# EAGLE design TeslaBMS_Shield_2 (EAGLE 6.6.0)
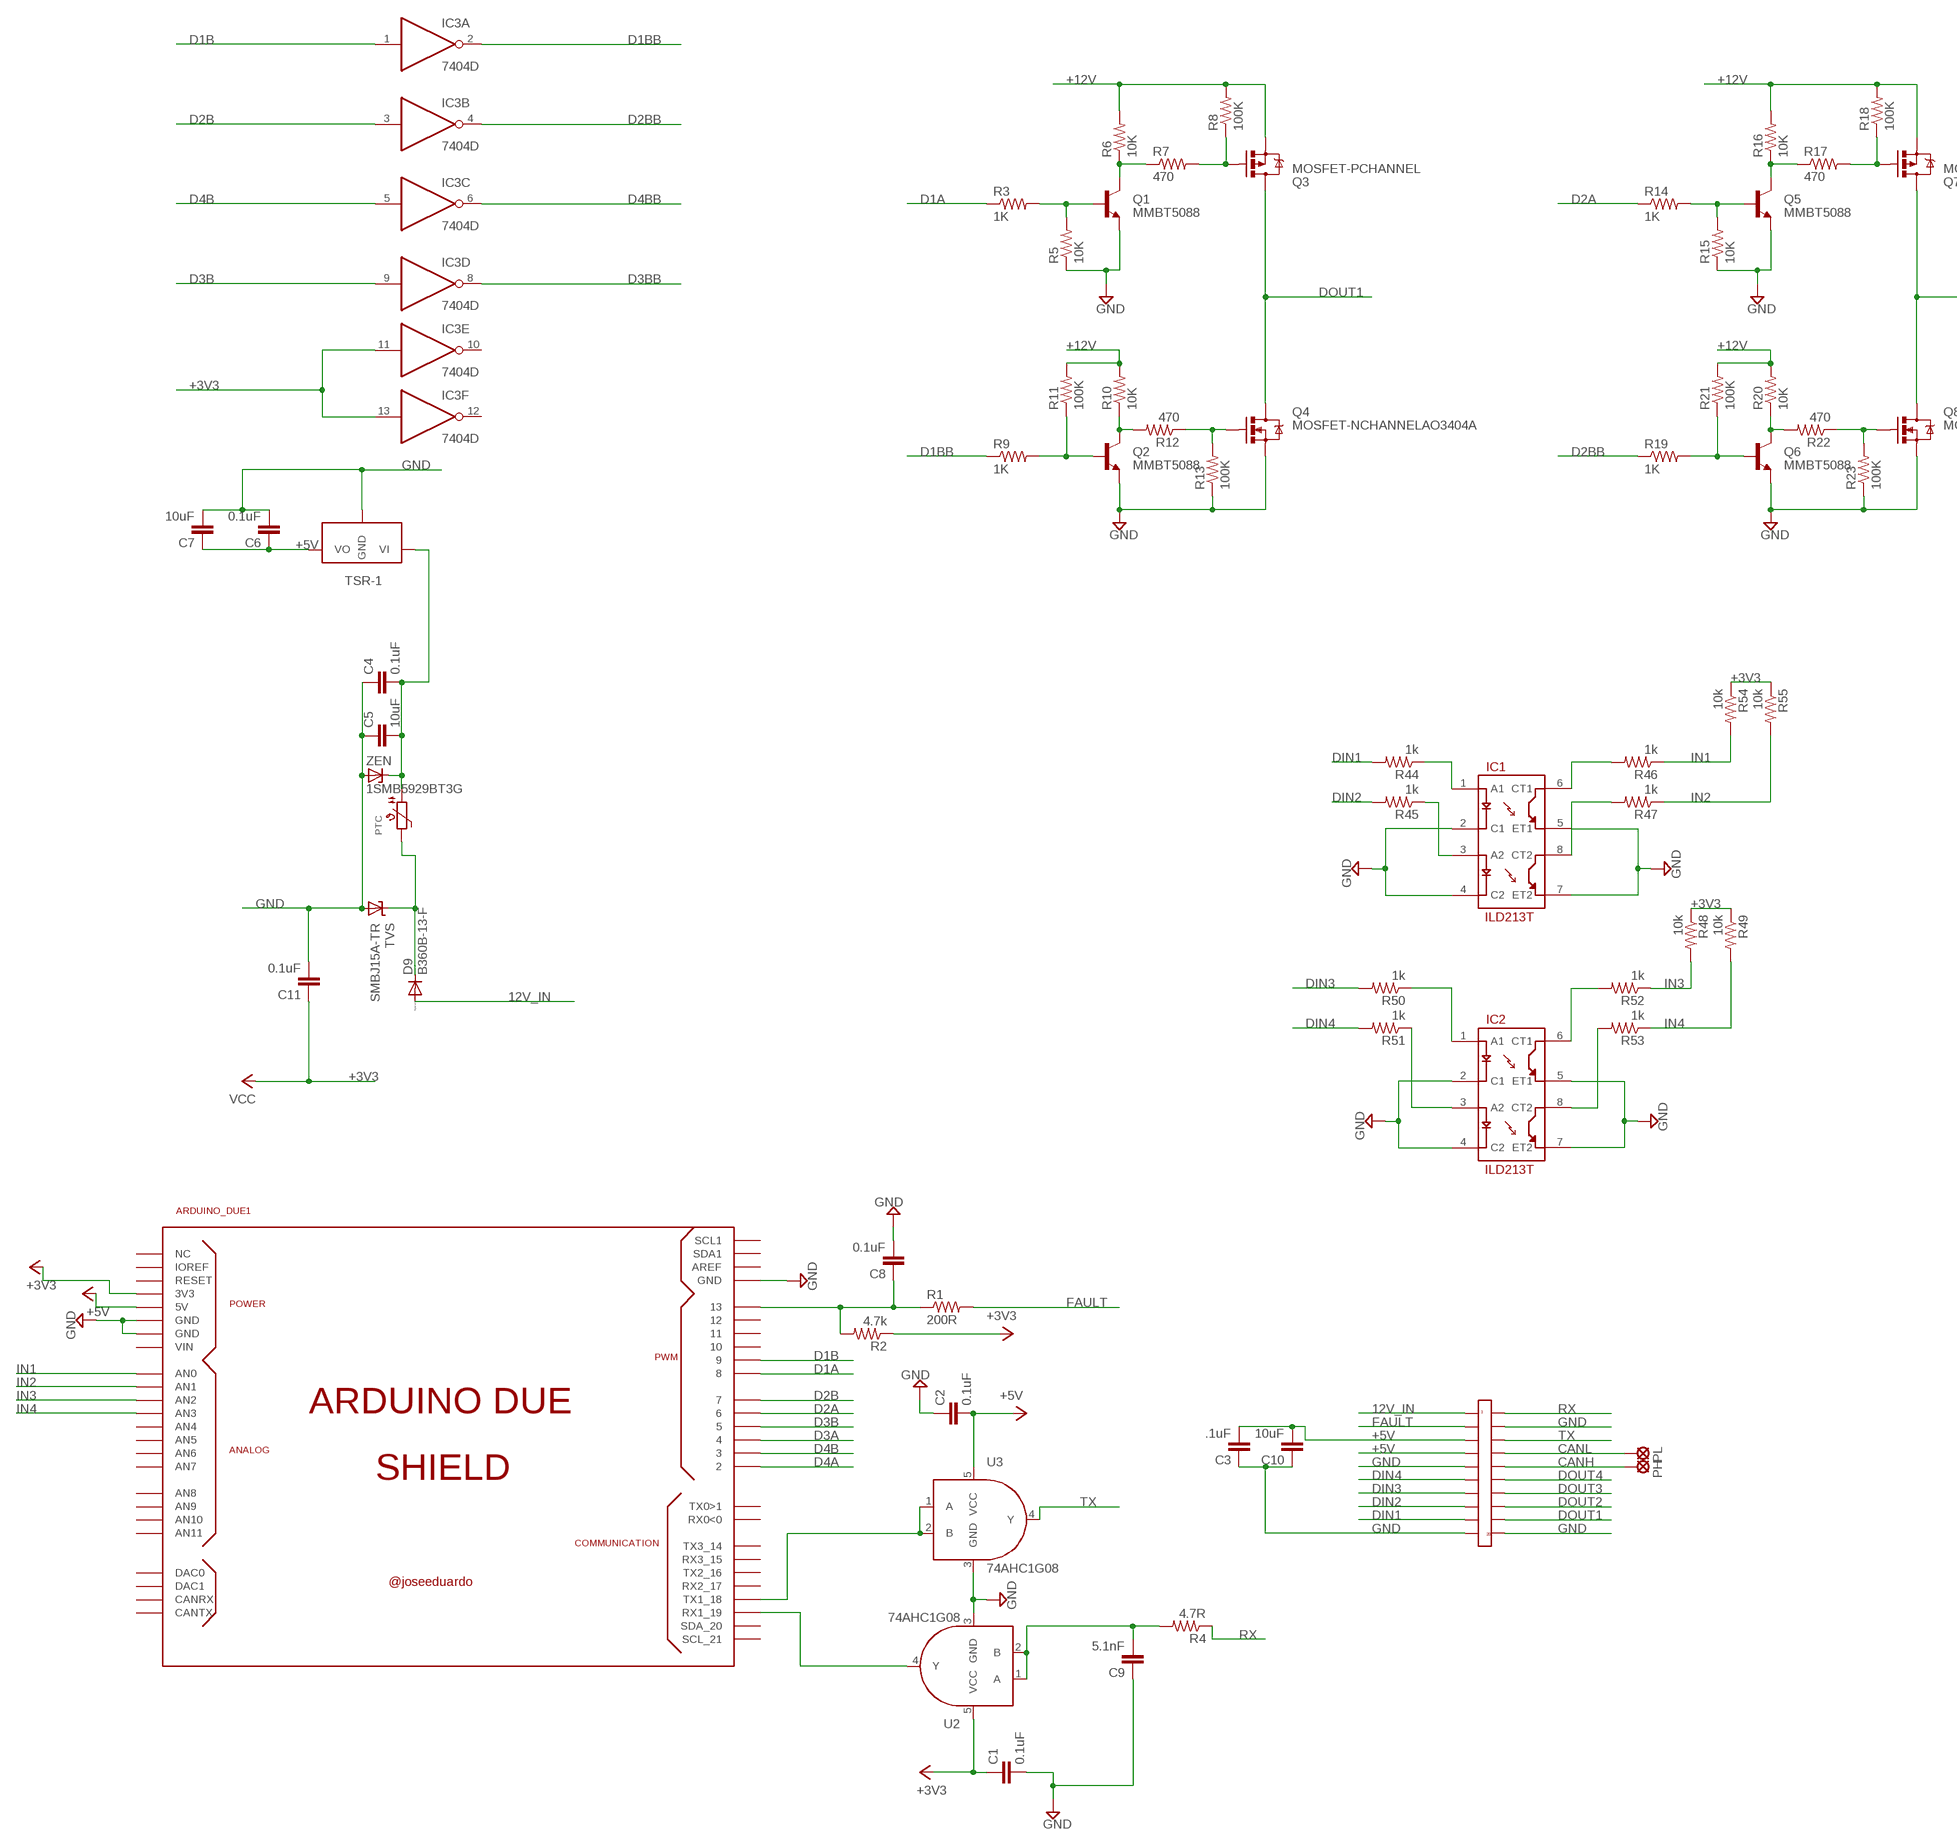
[diagram p0: schematic, sheet 1, part 1 of 2]
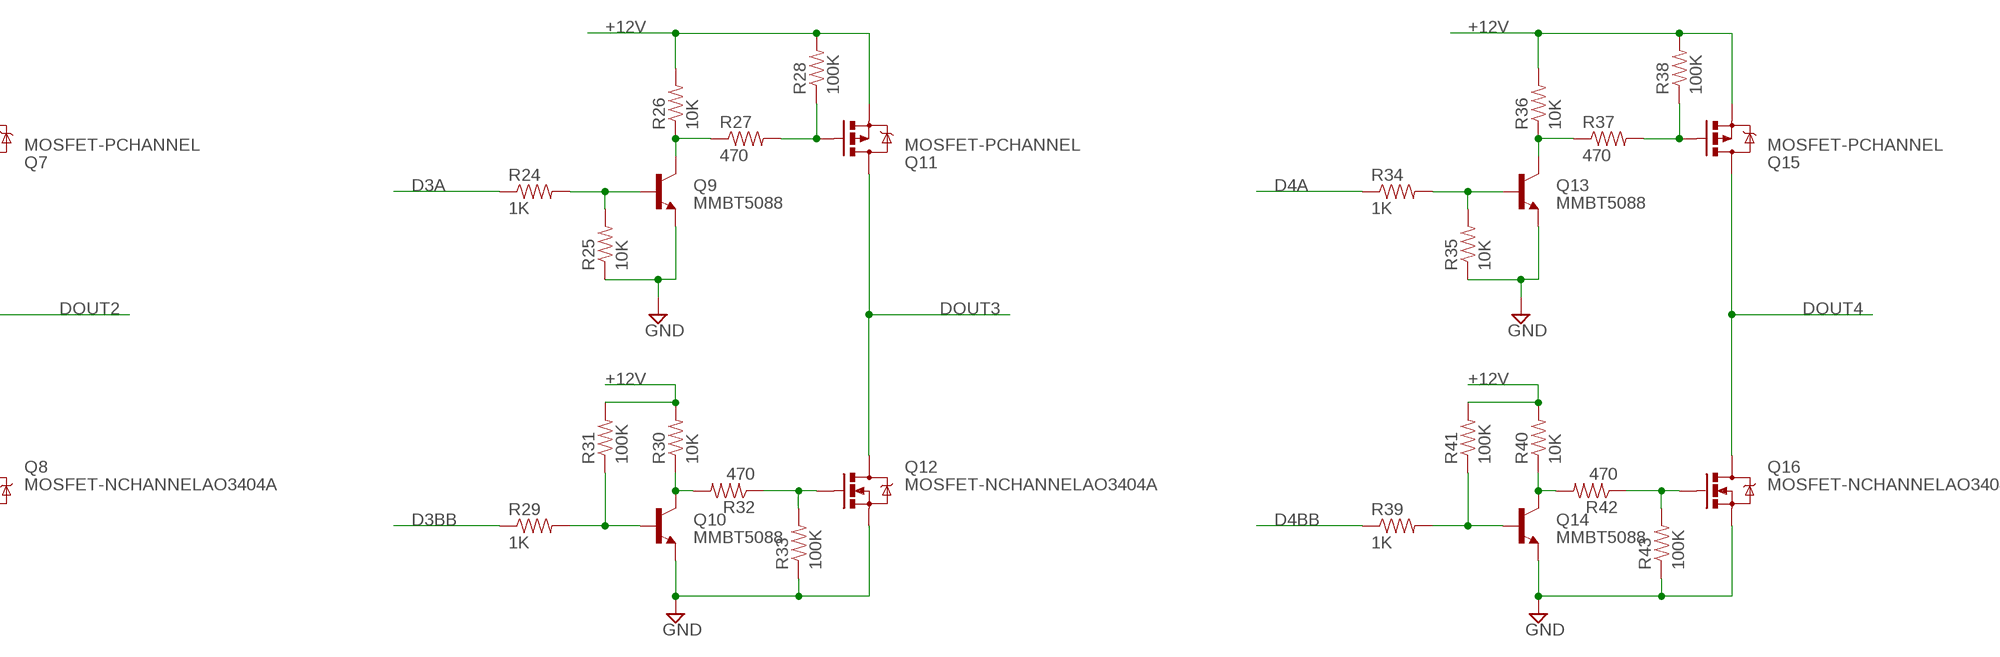
[diagram p1: schematic, sheet 1, part 2 of 2]

## Parts
ARDUINO_DUE1  ARDUINO_DUE_SHIELD  [ARDUINO_DUE_SHIELD]
C1  0.1uF  CAP0603-CAP  [0603-CAP]
C2  0.1uF  CAP0603-CAP  [0603-CAP]
C3  .1uF  CAP0603-CAP  [0603-CAP]
C4  0.1uF  CAP0805  [0805]
C5  10uF  CAP0805  [0805]
C6  0.1uF  CAP0805  [0805]
C7  10uF  CAP0805  [0805]
C8  0.1uF  CAP0603-CAP  [0603-CAP]
C9  5.1nF  CAP0603-CAP  [0603-CAP]
C10  10uF  CAP0603-CAP  [0603-CAP]
C11  0.1uF  CAP0805  [0805]
D9  B360B-13-F  DIODE-SMB  [SMB]
IC1  ILD213T  [SO08]
IC2  ILD213T  [SO08]
IC3  7404D  [SO14]
PH  SE11  [SE11]
PL  SE11  [SE11]
PTC  PTC1812  [PTC1812]
Q1  MMBT5088  TRANSISTOR_NPNMMBT5088  [SOT23-3]
Q2  MMBT5088  TRANSISTOR_NPNMMBT5088  [SOT23-3]
Q3  MOSFET-PCHANNEL  [SOT23-3]
Q4  MOSFET-NCHANNELAO3404A  [SOT23-3]
Q5  MMBT5088  TRANSISTOR_NPNMMBT5088  [SOT23-3]
Q6  MMBT5088  TRANSISTOR_NPNMMBT5088  [SOT23-3]
Q7  MOSFET-PCHANNEL  [SOT23-3]
Q8  MOSFET-NCHANNELAO3404A  [SOT23-3]
Q9  MMBT5088  TRANSISTOR_NPNMMBT5088  [SOT23-3]
Q10  MMBT5088  TRANSISTOR_NPNMMBT5088  [SOT23-3]
Q11  MOSFET-PCHANNEL  [SOT23-3]
Q12  MOSFET-NCHANNELAO3404A  [SOT23-3]
Q13  MMBT5088  TRANSISTOR_NPNMMBT5088  [SOT23-3]
Q14  MMBT5088  TRANSISTOR_NPNMMBT5088  [SOT23-3]
Q15  MOSFET-PCHANNEL  [SOT23-3]
Q16  MOSFET-NCHANNELAO3404A  [SOT23-3]
R1  200R  RESISTOR0603-RES  [0603-RES]
R2  4.7k  RESISTOR0603-RES  [0603-RES]
R3  1K  RESISTOR0402  [0402-RES]
R4  4.7R  RESISTOR0603-RES  [0603-RES]
R5  10K  RESISTOR0402  [0402-RES]
R6  10K  RESISTOR0402  [0402-RES]
R7  470  RESISTOR0402  [0402-RES]
R8  100K  RESISTOR0402  [0402-RES]
R9  1K  RESISTOR0402  [0402-RES]
R10  10K  RESISTOR0402  [0402-RES]
R11  100K  RESISTOR0402  [0402-RES]
R12  470  RESISTOR0402  [0402-RES]
R13  100K  RESISTOR0402  [0402-RES]
R14  1K  RESISTOR0402  [0402-RES]
R15  10K  RESISTOR0402  [0402-RES]
R16  10K  RESISTOR0402  [0402-RES]
R17  470  RESISTOR0402  [0402-RES]
R18  100K  RESISTOR0402  [0402-RES]
R19  1K  RESISTOR0402  [0402-RES]
R20  10K  RESISTOR0402  [0402-RES]
R21  100K  RESISTOR0402  [0402-RES]
R22  470  RESISTOR0402  [0402-RES]
R23  100K  RESISTOR0402  [0402-RES]
R24  1K  RESISTOR0402  [0402-RES]
R25  10K  RESISTOR0402  [0402-RES]
R26  10K  RESISTOR0402  [0402-RES]
R27  470  RESISTOR0402  [0402-RES]
R28  100K  RESISTOR0402  [0402-RES]
R29  1K  RESISTOR0402  [0402-RES]
R30  10K  RESISTOR0402  [0402-RES]
R31  100K  RESISTOR0402  [0402-RES]
R32  470  RESISTOR0402  [0402-RES]
R33  100K  RESISTOR0402  [0402-RES]
R34  1K  RESISTOR0402  [0402-RES]
R35  10K  RESISTOR0402  [0402-RES]
R36  10K  RESISTOR0402  [0402-RES]
R37  470  RESISTOR0402  [0402-RES]
R38  100K  RESISTOR0402  [0402-RES]
R39  1K  RESISTOR0402  [0402-RES]
R40  10K  RESISTOR0402  [0402-RES]
R41  100K  RESISTOR0402  [0402-RES]
R42  470  RESISTOR0402  [0402-RES]
R43  100K  RESISTOR0402  [0402-RES]
R44  1k  RESISTOR0603-RES  [0603-RES]
R45  1k  RESISTOR0603-RES  [0603-RES]
R46  1k  RESISTOR0603-RES  [0603-RES]
R47  1k  RESISTOR0603-RES  [0603-RES]
R48  10k  RESISTOR0603-RES  [0603-RES]
R49  10k  RESISTOR0603-RES  [0603-RES]
R50  1k  RESISTOR0603-RES  [0603-RES]
R51  1k  RESISTOR0603-RES  [0603-RES]
R52  1k  RESISTOR0603-RES  [0603-RES]
R53  1k  RESISTOR0603-RES  [0603-RES]
R54  10k  RESISTOR0603-RES  [0603-RES]
R55  10k  RESISTOR0603-RES  [0603-RES]
TVS  SMBJ15A-TR  SUPPRESSOR-SMBJ  [SMBJ]
U2  74AHC1G08  [SOT353]
U3  74AHC1G08  [SOT353]
U9  TSR-1  [TSR-1]
U$2  VAL-U-LOK-20PIN  [VALULOK-20]
ZEN  1SMB5929BT3G  ZENER-DIODESMB  [SMB]

## Nets
12V_IN: D9.A U$2.P$1
+3V3: ARDUINO_DUE1.3V3 C1.1 C11.1 IC3.11(E:I) IC3.13(F:I) R2.1 R48.1 R49.1 R54.1 R55.1 U2.5(VCC) ; supply symbol labelled VCC
+5V: ARDUINO_DUE1.5V0(5V) C2.2 C3.2 C6.1 C7.1 C10.2 U3.5(VCC) U9.P$3(VO) U$2.P$3 U$2.P$4
+12V: C4.2 C5.2 PTC.P$1 Q3.2(S) Q7.2(S) Q11.2(S) Q15.2(S) R6.2 R8.2 R10.2 R11.2 R16.2 R18.2 R20.2 R21.2 R26.2 R28.2 R30.2 R31.2 R36.2 R38.2 R40.2 R41.2 U9.P$1(VI) ZEN.C
CANH: PH.MP U$2.P$15
CANL: PL.MP U$2.P$14
D1A: ARDUINO_DUE1.8 R3.1
D1B: ARDUINO_DUE1.9 IC3.1(A:I)
D1BB: IC3.2(A:O) R9.1
D2A: ARDUINO_DUE1.6 R14.1
D2B: ARDUINO_DUE1.7 IC3.3(B:I)
D2BB: IC3.4(B:O) R19.1
D3A: ARDUINO_DUE1.4 R24.1
D3B: ARDUINO_DUE1.5 IC3.9(D:I)
D3BB: IC3.8(D:O) R29.1
D4A: ARDUINO_DUE1.2 R34.1
D4B: ARDUINO_DUE1.3 IC3.5(C:I)
D4BB: IC3.6(C:O) R39.1
DIN1: R44.2 U$2.P$9
DIN2: R45.2 U$2.P$8
DIN3: R50.2 U$2.P$7
DIN4: R51.2 U$2.P$6
DOUT1: Q3.3(D) Q4.3(D) U$2.P$19
DOUT2: Q7.3(D) Q8.3(D) U$2.P$18
DOUT3: Q11.3(D) Q12.3(D) U$2.P$17
DOUT4: Q15.3(D) Q16.3(D) U$2.P$16
FAULT: R1.2 U$2.P$2
GND: ARDUINO_DUE1.GND ARDUINO_DUE1.GND_1(GND) ARDUINO_DUE1.GND_4(GND) C1.2 C2.1 C3.1 C4.1 C5.1 C6.2 C7.2 C8.2 C9.1 C10.1 C11.2 IC1.2(C1) IC1.4(C2) IC1.5(ET1) IC1.7(ET2) IC2.2(C1) IC2.4(C2) IC2.5(ET1) IC2.7(ET2) Q1.2(E) Q2.2(E) Q4.2(S) Q5.2(E) Q6.2(E) Q8.2(S) Q9.2(E) Q10.2(E) Q12.2(S) Q13.2(E) Q14.2(E) Q16.2(S) R5.1 R13.1 R15.1 R23.1 R25.1 R33.1 R35.1 R43.1 TVS.A U2.3(GND) U3.3(GND) U9.P$2(GND) U$2.P$5 U$2.P$10 U$2.P$12 U$2.P$20 ZEN.A
IN1: ARDUINO_DUE1.A0(AN0) R46.1 R54.2
IN2: ARDUINO_DUE1.A1(AN1) R47.1 R55.2
IN3: ARDUINO_DUE1.A2(AN2) R48.2 R52.1
IN4: ARDUINO_DUE1.A3(AN3) R49.2 R53.1
N$1: D9.C PTC.P$2 TVS.C
N$2: ARDUINO_DUE1.19(RX1_19) U2.4(Y)
N$3: ARDUINO_DUE1.18(TX1_18) U3.1(A) U3.2(B)
N$4: Q1.1(B) R3.2 R5.2
N$5: Q3.1(G) R7.2 R8.1
N$6: IC1.3(A2) R45.1
N$7: ARDUINO_DUE1.13 C8.1 R1.1 R2.2
N$8: Q1.3(C) R6.1 R7.1
N$9: C9.2 R4.2 U2.1(A) U2.2(B)
N$10: Q5.1(B) R14.2 R15.2
N$11: Q2.1(B) R9.2 R11.1
N$12: Q4.1(G) R12.1 R13.2
N$13: Q2.3(C) R10.1 R12.2
N$14: Q5.3(C) R16.1 R17.1
N$15: Q7.1(G) R17.2 R18.1
N$16: Q6.1(B) R19.2 R21.1
N$17: Q8.1(G) R22.1 R23.2
N$18: Q6.3(C) R20.1 R22.2
N$19: Q9.1(B) R24.2 R25.2
N$20: Q9.3(C) R26.1 R27.1
N$21: Q11.1(G) R27.2 R28.1
N$22: Q10.1(B) R29.2 R31.1
N$23: Q12.1(G) R32.1 R33.2
N$24: Q10.3(C) R30.1 R32.2
N$25: Q13.1(B) R34.2 R35.2
N$26: Q13.3(C) R36.1 R37.1
N$27: Q15.1(G) R37.2 R38.1
N$28: Q14.1(B) R39.2 R41.1
N$29: Q16.1(G) R42.1 R43.2
N$30: Q14.3(C) R40.1 R42.2
N$31: IC1.1(A1) R44.1
N$32: IC2.6(CT1) R52.2
N$36: IC2.8(CT2) R53.2
N$37: IC1.6(CT1) R46.2
N$38: IC1.8(CT2) R47.2
N$41: IC2.1(A1) R50.1
N$42: IC2.3(A2) R51.1
RX: R4.1 U$2.P$11
TX: U3.4(Y) U$2.P$13
Unconnected: ARDUINO_DUE1.0(RX0<0) ARDUINO_DUE1.1(TX0>1) ARDUINO_DUE1.10 ARDUINO_DUE1.11 ARDUINO_DUE1.12 ARDUINO_DUE1.14(TX3_14) ARDUINO_DUE1.15(RX3_15) ARDUINO_DUE1.16(TX2_16) ARDUINO_DUE1.17(RX2_17) ARDUINO_DUE1.20(SDA_20) ARDUINO_DUE1.21(SCL_21) ARDUINO_DUE1.A4(AN4) ARDUINO_DUE1.A5(AN5) ARDUINO_DUE1.A6(AN6) ARDUINO_DUE1.A7(AN7) ARDUINO_DUE1.A8(AN8) ARDUINO_DUE1.A9(AN9) ARDUINO_DUE1.A10(AN10) ARDUINO_DUE1.A11(AN11) ARDUINO_DUE1.AREF ARDUINO_DUE1.CANRX ARDUINO_DUE1.CANTX ARDUINO_DUE1.DAC0 ARDUINO_DUE1.DAC1 ARDUINO_DUE1.IOREF ARDUINO_DUE1.NC_2(NC) ARDUINO_DUE1.RESET ARDUINO_DUE1.SCL1 ARDUINO_DUE1.SDA1 ARDUINO_DUE1.VIN IC3.10(E:O) IC3.12(F:O)

## Power pins joined to a net without a drawn wire
+3V3: IC3.14(P:VCC)
GND: IC3.7(P:GND)

## Library data of the parts
ARDUINO_DUE1 = arduino_due_shield:ARDUINO_DUE_SHIELD
C1-C11 = SparkFun-Passives:CAP: Capacitor Standard 0603 ceramic capacitor, and 0.1" leaded capacitor.
D9 = diode:DIODE-: DIODE
IC1 IC2 = SparkFun-DiscreteSemi:ILD213T: Dual optoisolator.
IC3 = 74xx-us:74*04: Hex INVERTER
PH PL = solpad:SE11: SOLDER PAD RTM, drill 1,1mm, distributor Buerklin, 07F810
PTC = microbuilder:PTC: PTC (Resettable Fuse) 1206 Package 250mA PTC (16V Max, Time-to-Trip: 0.08s) - Digikey: F2110CT-ND 1210 Package 100mA PTC (30V Max, Time-to-Trip: 0.6s) - Digikey: MF-USMF010-2CT-ND 1812 Package 750mA PTC (24V Max, Time-to-Trip: 0.2s) - Digikey: MF-MSMF075/24-2CT-ND
Q1 Q2 Q5 Q6 Q9 Q10 Q13 Q14 = SparkFun-DiscreteSemi:TRANSISTOR_NPN: Generic NPN BJT MMBT2222A - TRANS-08049 (SOT-23, 1A 40V) MPSA42 - TRANS-09116 (SOT-23, 500mA 300V) MMBT5088LT1G - TRANS-11160 (SOT-23, 50 mA 30V) BC547 - COM-08928 <http://www.sparkfun.com/products/8928> (TO-92 45V 100mA) (1.Collector 2.Base 3.Emitter) 2N3904 - COM-00521 <http://www.sparkfun.com/products/521> (TO-92 40V 200mA) (1.Emitter 2.Base 3.Collector) P2N2222A - COM-12852 <http://www.sparkfun.com/products/12852> (TO-92 40V 600mA) (1.Collector 2.Base 3.Emitter); PROD_ID: TRANS-11160
Q3 Q7 Q11 Q15 = SparkFun-DiscreteSemi:MOSFET-PCHANNEL: Generic PMOSFET IRLML2244 - TRANS-11153 (SOT-23 -20V -4.3A) (1.Gate 2.Source 3.Drain) FQP27P06 - COM-10349 <http://www.sparkfun.com/products/10349> (TO-220 -60V -27A) (1.Gate 2.Source 3.Drain); PROD_ID: TRANS-08285
Q4 Q8 Q12 Q16 = SparkFun-DiscreteSemi:MOSFET-NCHANNEL: Common NMOSFET Parts MFG P/N Store ID Prod ID FDD8780 TRANS-09984 SI7820DN TRANS-11055 FDS6630A IC-08089 2N7002PW TRANS-11151 FQP30N06L COM-10213 TRANS-10060 BSS123LT1G TRANS-08345 BSS138 TRANS-00830 BS170 2N7000; PROD_ID: TRAN-12988
R1 R2 R4 R44-R55 = SparkFun-Passives:RESISTOR: Resistor Basic schematic elements and footprints for 0603, 1206, and PTH resistors.
R3 R5-R43 = SparkFun-Resistors:RESISTOR: Resistor Basic schematic elements and footprints for 0603, 1206, and PTH resistors.
TVS = diode:SUPPRESSOR-: Suppressor diode
U2 U3 = SparkFun-DigitalIC:74AHC1G08: Single 2-input AND gate; PROD_ID: IC-10841
U9 = Traco:TSR-1
U$2 = ck_custom:VAL-U-LOK-20PIN
ZEN = diode:ZENER-DIODE: Z-Diode

## Net classes
0 default: width 0.203 mm, drill 0.305 mm, clearance 0.203 mm

## Board
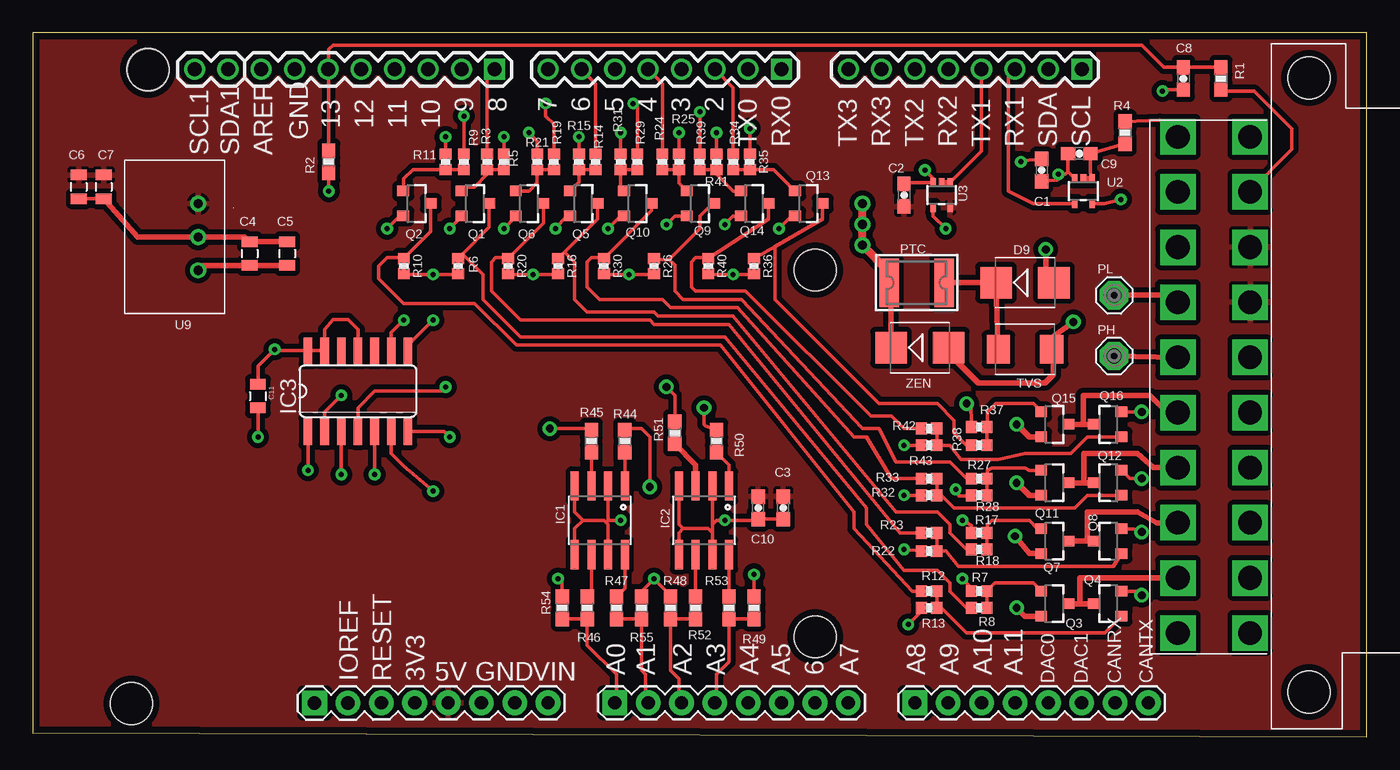
[diagram p2: board, top side]
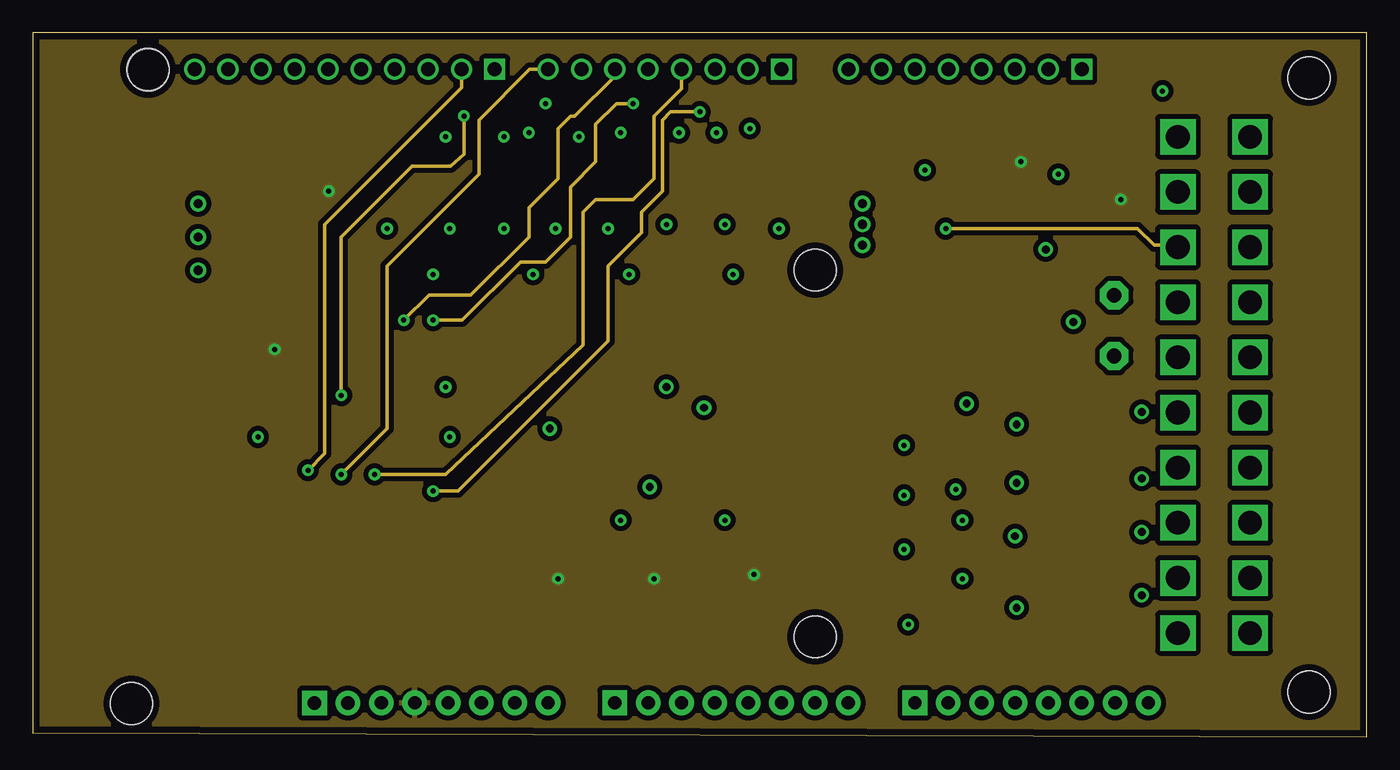
[diagram p3: board, inner layer Route2]
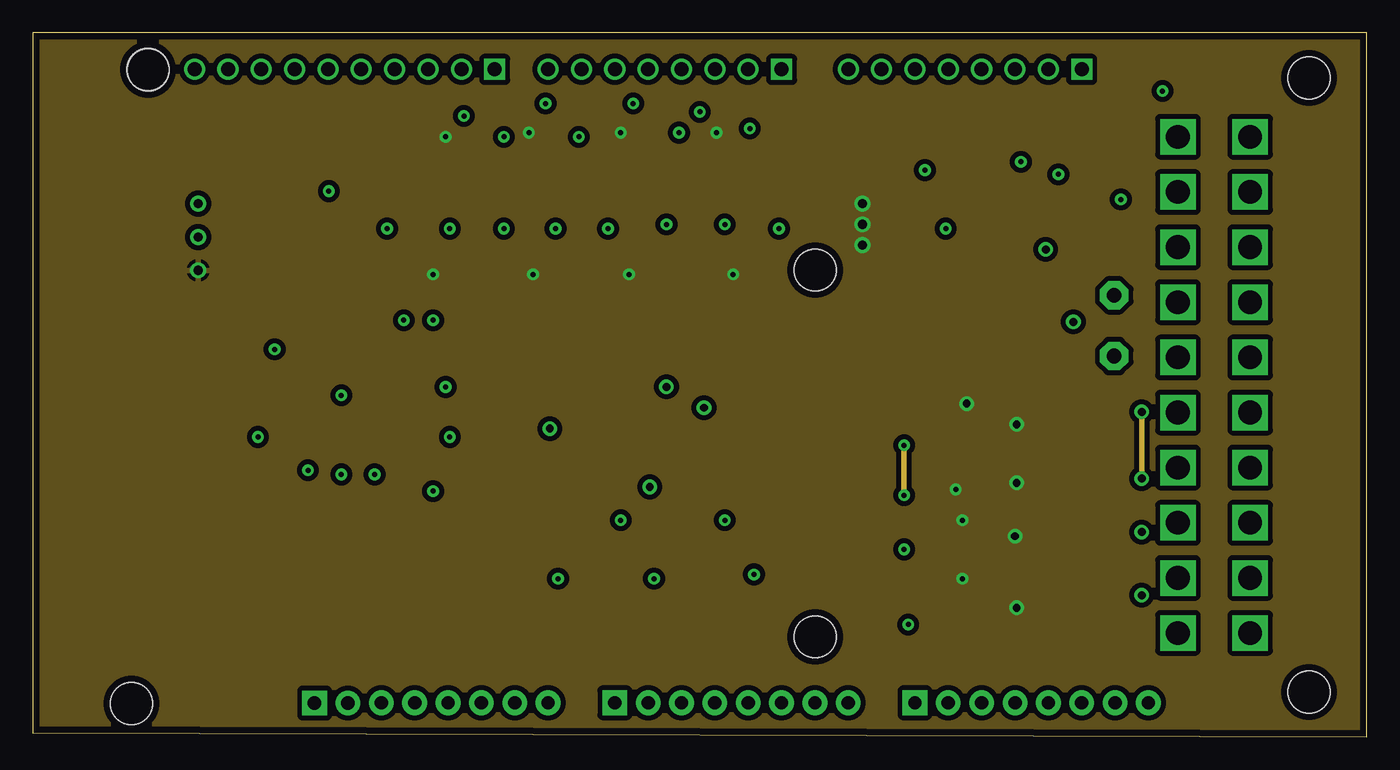
[diagram p4: board, inner layer Route15]
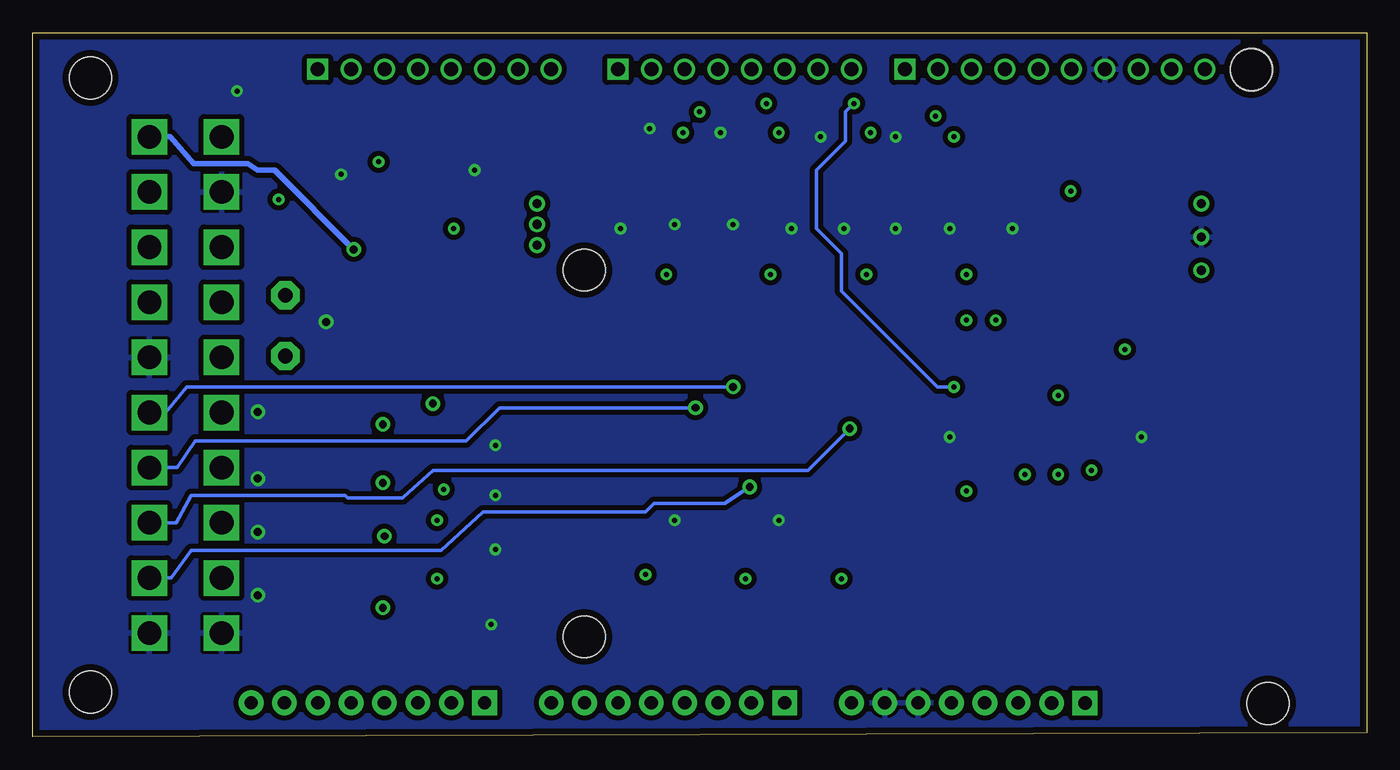
[diagram p5: board, bottom side, seen from below]

Size 101.59 x 53.65 mm. Coordinates in mm from the lower left corner, seen from the top.
Outline: 0,0.32 101.59,0 101.59,53.65 0,53.65 0,0.32
Copper layers (1+2*15+16): Top 0.0178mm / dielectric 12mil / Route2 0.0356mm / dielectric 28mil / Route15 0.0356mm / dielectric 12mil / Bottom 0.0178mm
Design rules "SSC-EAGLE-4Lyr_v1.0.0.3 *": minimum track width 6mil, minimum drill 8mil, track to track 15mil, track to pad 15mil, pad to pad 15mil, via to via 15mil, smd to smd 6mil, copper to edge 20mil, drill to drill 16mil, minimum pad ring 10mil, minimum via ring 10mil, stop-mask expansion 10mil, vias tented up to drill 0mil, thermal gap 10mil

### Footprints (pad centres in the part's own frame; a part is rotated, then mirrored left to right if it is on the bottom)
ARDUINO_DUE_SHIELD = drill 1.067 square: 0 63.373,51.816; 8 41.529,51.816; 21 86.233,51.816 | drill 1.067: 1 60.833,51.816; 2 58.293,51.816; 3 55.753,51.816; 4 53.213,51.816; 5 50.673,51.816; 6 48.133,51.816; 7 45.593,51.816; 9 38.989,51.816; 10 36.449,51.816; 11 33.909,51.816; 12 31.369,51.816; 13 28.829,51.816; 14 68.453,51.816; 15 70.993,51.816; 16 73.533,51.816; 17 76.073,51.816; 18 78.613,51.816; 19 81.153,51.816; 20 83.693,51.816; AREF 23.749,51.816; GND_4 26.289,51.816; SCL1 18.669,51.816; SDA1 21.209,51.816 | drill 1.016 pad 1.88: 3V3 35.433,3.556; 5V0 37.973,3.556; A1 53.213,3.556; A2 55.753,3.556; A3 58.293,3.556; A4 60.833,3.556; A5 63.373,3.556; A6 65.913,3.556; A7 68.453,3.556; A9 76.073,3.556; A10 78.613,3.556; A11 81.153,3.556; CANRX 88.773,3.556; CANTX 91.313,3.556; DAC0 83.693,3.556; DAC1 86.233,3.556; GND 40.513,3.556; GND_1 43.053,3.556; IOREF 30.346,3.543; RESET 32.893,3.555; VIN 45.593,3.556 | drill 1.016 pad 1.88 square: A0 50.673,3.556; A8 73.533,3.556; NC_2 27.806,3.543 | hole 3.2: 15.113,51.816; 15.138,51.765; 13.868,3.505; 65.938,36.525; 65.938,8.585
0603-CAP = smd 1.1 x 1: 1 -0.85,0; 2 0.85,0
0805 = smd 0.8 x 1.2: 1 -0.9,0; 2 0.9,0
SMB = smd 2.4 x 2.4: A 2.2,0; C -2.2,0
SO08 = smd 0.61 x 2.21: 1 -1.905,-2.616; 2 -0.635,-2.616; 3 0.635,-2.616; 4 1.905,-2.616; 5 1.905,2.616; 6 0.635,2.616; 7 -0.635,2.616; 8 -1.905,2.616
SO14 = smd 0.66 x 2.032: 1 -3.81,-3.073; 2 -2.54,-3.073; 3 -1.27,-3.073; 4 0,-3.073; 5 1.27,-3.073; 6 2.54,-3.073; 7 3.81,-3.073; 8 3.81,3.073; 9 2.54,3.073; 10 1.27,3.073; 11 0,3.073; 12 -1.27,3.073; 13 -2.54,3.073; 14 -3.81,3.073
SE11 = drill 1.118 pad 2.159 octagon: MP 0,0
PTC1812 = smd 1.5 x 3.7: P$1 -2.1,0; P$2 2.1,0
SOT23-3 = smd 0.8 x 0.9: 1 -0.95,-1; 2 0.95,-1; 3 0,1.1
0603-RES = smd 1.1 x 1: 1 -0.85,0; 2 0.85,0
0402-RES = smd 0.85 x 0.9: 1 -0.58,0; 2 0.58,0
SMBJ = smd 1.78 x 2.16: A 2.04,0; C -2.03,0
SOT353 = smd 0.42 x 0.7: 1 -0.65,-0.95; 2 0,-0.95; 3 0.65,-0.95; 4 0.65,0.95; 5 -0.65,0.95
TSR-1 = drill 0.7: P$1 -2.55,-1.8; P$2 -0.01,-1.8; P$3 2.53,-1.8
VALULOK-20 = drill 1.8 square: P$1 0,0; P$2 0,4.2; P$3 0,8.4; P$4 0,12.6; P$5 0,16.8; P$6 0,21; P$7 0,25.2; P$8 0,29.4; P$9 0,33.6; P$10 0,37.8; P$11 5.5,0; P$12 5.5,4.2; P$13 5.5,8.4; P$14 5.5,12.6; P$15 5.5,16.8; P$16 5.5,21; P$17 5.5,25.2; P$18 5.5,29.4; P$19 5.5,33.6; P$20 5.5,37.8 | hole 3.2: -4.5,-4.5; -4.5,42.3

### Placement (x,y rotation side)
ARDUINO_DUE1  -6.35,-0.95 0 top
C1  76.84,43.18 270 top
C2  66.36,41.27 270 top
C3  57.15,17.46 90 top
C4  16.51,36.83 270 top
C5  19.37,36.83 270 top
C6  3.49,41.91 270 top
C7  5.4,41.91 270 top
C8  87.63,50.16 270 top
C9  79.69,44.45 0 top
C10  55.24,17.46 90 top
C11  17.15,25.97 270 top
D9  75.57,34.61 0 top
IC1  43.18,16.51 180 top
IC2  51.12,16.51 180 top
IC3  24.77,26.35 0 top
PH  82.36,29.02 0 top
PL  82.36,33.66 0 top
PTC  67.31,34.61 0 top
Q1  33.66,40.64 270 top
Q2  29.21,40.64 270 top
Q3  77.79,10.16 270 top
Q4  81.92,10.16 90 top
Q5  41.91,40.64 270 top
Q6  37.78,40.64 270 top
Q7  77.79,14.92 270 top
Q8  81.92,14.92 90 top
Q9  50.8,40.64 270 top
Q10  46.04,40.64 270 top
Q11  77.79,19.37 270 top
Q12  81.92,19.37 90 top
Q13  59.05,40.64 270 top
Q14  54.93,40.64 270 top
Q15  77.79,23.81 270 top
Q16  81.92,23.81 90 top
R1  90.49,50.16 270 top
R2  22.54,43.81 90 top
R3  34.61,43.81 270 top
R4  83.19,46.04 270 top
R5  35.88,43.81 270 top
R6  32.38,35.88 270 top
R7  72.07,9.84 0 top
R8  72.07,11.11 180 top
R9  32.83,43.81 270 top
R10  28.26,35.88 270 top
R11  31.43,43.81 90 top
R12  68.26,11.11 180 top
R13  68.26,9.84 0 top
R14  42.86,43.81 270 top
R15  41.59,43.81 270 top
R16  40,35.88 270 top
R17  72.07,14.29 0 top
R18  72.07,15.56 180 top
R19  39.69,43.81 270 top
R20  36.2,35.88 270 top
R21  38.42,43.81 90 top
R22  68.26,15.56 180 top
R23  68.26,14.16 0 top
R24  47.94,43.81 270 top
R25  49.21,43.81 270 top
R26  47.31,35.88 270 top
R27  72.07,19.68 0 top
R28  72.07,18.41 180 top
R29  46.04,43.81 270 top
R30  43.5,35.88 270 top
R31  44.77,43.81 90 top
R32  68.26,19.68 180 top
R33  68.26,18.41 0 top
R34  53.34,43.81 270 top
R35  54.61,43.81 270 top
R36  54.93,35.88 270 top
R37  72.07,22.22 0 top
R38  72.07,23.62 180 top
R39  50.8,43.81 270 top
R40  51.43,35.88 270 top
R41  52.07,43.81 90 top
R42  68.26,23.5 180 top
R43  68.26,22.22 0 top
R44  45.09,22.54 90 top
R45  42.55,22.54 90 top
R46  42.23,9.84 90 top
R47  44.45,9.84 90 top
R48  48.58,9.84 270 top
R49  54.93,9.84 270 top
R50  52.07,22.54 90 top
R51  48.89,23.18 90 top
R52  50.48,9.84 90 top
R53  53.02,9.84 90 top
R54  40.32,9.84 270 top
R55  46.35,9.84 270 top
TVS  75.57,29.53 0 top
U2  80.01,41.59 180 top
U3  69.22,41.27 180 top
U9  10.79,38.1 90 top
U$2  92.71,45.72 180 top
ZEN  67.56,29.65 0 top

### Tracks (layer width: path | path; a pad name or v marks a point on that pad's centre or on a via)
12V_IN  (via drill 0.6)
  Top 0.406: v77.15,37.15 77.15,34.63 D9.A
  Bottom 0.406: U$2.P$1 91.12,45.72 89.34,43.69 85.22,43.69 84.46,43.18 83.19,43.18 v77.15,37.15
+3V3  (via drill 0.38)
  Top 0.254: v54.93,12.38 R49.1 | R55.1 46.35,11.11 v47.31,12.07 48.58,10.8 R48.1 | R54.1 40.32,11.75 v40,12.07 | R2.1 v22.54,41.59 | v82.87,40.96 81.61,40.64 U2.5 | C1.1 75.35,43.92 v75.25,43.81 | IC3.11 24.77,31.05 24,31.81 22.86,31.81 22.23,31.05 IC3.13 IC3.14 18.52,29.43 v18.41,29.53 17.15,28.26 C11.1
  pour Route2: 0,53.66 101.6,53.66 101.6,0 0,0
+5V
  pour Top: 0,53.66 101.92,53.02 101.92,0.32 0,0.32
+12V  (via drill 0.38, 0.6, 0.7)
  Top 0.254: R10.2 28.26,35.24 v30.48,35.24 32.38,35.24 R6.2 | R16.2 40,35.24 v38.1,35.24 36.2,35.24 R20.2 | R30.2 43.5,35.24 v45.4,35.24 47.31,35.24 R26.2 | R40.2 51.43,35.24 v53.34,35.24 54.93,35.24 R36.2 | R11.2 v31.43,45.72 | R21.2 38.42,45.4 v37.78,46.04 | R31.2 v44.77,46.04 | v52.07,46.04 R41.2 | R8.2 71.49,11.38 v70.8,12.07 | R18.2 71.49,16.14 v70.8,16.51 | R28.2 71.44,18.36 70.54,18.36 v70.29,18.86 | R38.2 71.49,24.18 71.44,25.08 v71.12,25.4
  Top 0.406: C5.2 C4.2 12.97,35.93 U9.P$1 | Q7.2 75.88,13.97 v74.8,15.3 | Q3.2 75.56,9.21 v74.93,9.84 | Q11.2 75.88,18.42 v74.93,19.37 | Q15.2 75.88,22.86 v74.93,23.81 | ZEN.C 65.36,34.45 PTC.P$1
  Top 0.61: PTC.P$1 65.21,35.44 v63.18,37.46 v63.18,40.64
  other vias: 63.18,39.05
  pour Route15: 0,53.66 101.6,53.66 101.6,0 0,0
CANH
  Top 0.406: PH.MP 87.18,28.89 U$2.P$15
CANL
  Top 0.406: PL.MP 86.68,33.66 U$2.P$14
D1A
  Top 0.254: R3.1 34.61,50.29 ARDUINO_DUE1.8
D1B  (via drill 0.38)
  Top 0.254: v20.95,20.32 IC3.1
  Route2 0.254: ARDUINO_DUE1.9 32.64,49.47 22.23,39.05 22.23,21.59 v20.95,20.32
D1BB  (via drill 0.38)
  Top 0.254: IC3.2 22.23,24.77 v23.49,26.04 | v32.83,47.31 R9.1
  Route2 0.254: v23.49,26.04 23.49,38.1 28.89,43.5 31.8,43.5 R9.1 v32.83,47.31
D2A
  Top 0.254: R14.1 42.86,49.78 ARDUINO_DUE1.6
D2B  (via drill 0.38)
  Top 0.254: v23.49,20 IC3.3
  Route2 0.254: ARDUINO_DUE1.7 37.85,50.86 33.97,46.99 33.97,42.86 26.99,35.88 26.99,23.5 v23.49,20
D2BB  (via drill 0.38)
  Top 0.254: IC3.4 24.77,25.08 26.03,26.35 31.12,26.35 v31.43,26.67 | v39.05,48.26 39.05,47.31 39.69,46.67 R19.1
  Bottom 0.254: v31.43,26.67 32.7,26.67 40,33.97 40,36.83 41.91,38.74 41.91,43.18 39.69,45.4 39.69,47.63 v39.05,48.26
D3A
  Top 0.254: R24.1 47.94,49.78 ARDUINO_DUE1.4
D3B  (via drill 0.38)
  Top 0.254: v28.26,31.75 27.3,30.8 IC3.9
  Route2 0.254: ARDUINO_DUE1.5 44.32,50.36 41.27,47.31 40.96,47.31 40,46.35 40,42.55 37.78,40.32 37.78,38.1 33.34,33.66 30.16,33.66 v28.26,31.75
D3BB  (via drill 0.38)
  Top 0.254: IC3.8 28.57,29.84 v30.48,31.75 | v45.72,48.26 46.04,47.94 R29.1
  Route2 0.254: v30.48,31.75 32.7,31.75 37.15,36.2 39.05,36.2 40.96,38.1 40.96,41.91 42.86,43.81 42.86,46.67 44.45,48.26 v45.72,48.26
D4A
  Top 0.254: R34.1 53.34,49.47 ARDUINO_DUE1.2
D4B  (via drill 0.38)
  Top 0.254: v26.03,20 IC3.5
  Route2 0.254: ARDUINO_DUE1.3 49.4,49.4 47.31,47.31 47.31,42.55 45.72,40.96 42.86,40.96 41.91,40.01 41.91,29.84 31.43,20 v26.03,20
D4BB  (via drill 0.38)
  Top 0.254: IC3.6 27.3,21.59 28.26,20.64 v30.48,18.73 | R39.1 v50.8,47.63
  Route2 0.254: v50.8,47.63 48.58,47.63 47.94,46.99 47.94,41.59 46.35,40.01 46.35,38.42 43.81,35.88 43.81,30.16 32.38,18.73 v30.48,18.73
DIN1  (via drill 0.6)
  Top 0.254: v46.99,19.05 46.99,22.86 46.35,23.5 45.19,23.5 R44.2
  Bottom 0.254: U$2.P$9 91.07,12.12 89.54,14.22 70.48,14.22 67.31,17.15 54.93,17.15 54.29,17.78 48.89,17.78 v46.99,19.05
DIN2  (via drill 0.6)
  Top 0.254: v39.37,23.5 42.44,23.5 R45.2
  Bottom 0.254: U$2.P$8 90.68,16.32 89.54,18.41 77.79,18.41 77.6,18.22 73.41,18.22 73.34,18.29 71.12,20.32 42.55,20.32 v39.37,23.5
DIN3  (via drill 0.6)
  Top 0.254: R50.2 51.22,23.71 51.12,23.81 v51.12,25.08
  Bottom 0.254: U$2.P$7 90.61,20.52 89.22,22.54 68.58,22.54 66.04,25.08 v51.12,25.08
DIN4  (via drill 0.6)
  Top 0.254: R51.2 48.89,26.04 v48.26,26.67
  Bottom 0.254: U$2.P$6 91.48,24.72 89.85,26.67 v48.26,26.67
DOUT1
  Top 0.406: Q4.3 79.74,10.16 | U$2.P$19 79.74,12.12 79.74,10.16 | Q3.3 79.74,10.16
DOUT2
  Top 0.406: Q8.3 80.33,14.92 | U$2.P$18 85.6,16.32 84.14,17.15 80.33,17.15 80.33,14.92 | Q7.3 80.33,14.92
DOUT3
  Top 0.406: Q12.3 80.06,19.37 | U$2.P$17 85.33,20.52 84.14,21.59 80.06,21.59 80.06,19.37 | Q11.3 80.06,19.37
DOUT4
  Top 0.406: Q16.3 80.01,23.81 | U$2.P$16 86.41,24.72 85.09,26.04 80.01,26.04 80.01,23.81 | 80.01,23.81 Q15.3
FAULT
  Top 0.254: U$2.P$2 92.71,41.59 95.89,44.77 95.89,46.35 93.03,49.21 90.59,49.21 R1.2
GND  (via drill 0.38, 0.6)
  Top 0.254: Q4.2 84.14,11.11 v84.46,10.8 | v84.46,24.77 Q16.2 | v84.46,19.68 83.55,19.68 Q12.2 | Q8.2 83.82,15.87 v84.46,15.62 | R25.1 v49.21,46.04 | R35.1 v54.61,46.35 | Q13.2 57.79,39.69 v56.83,38.74 | Q14.2 53.34,39.69 v52.7,39.05 | Q9.2 48.9,39.69 v48.26,39.05 | Q10.2 44.77,39.69 v43.81,38.74 | Q5.2 40.64,39.69 v39.81,38.74 | R15.1 v41.59,45.72 | R5.1 v35.88,45.72 | Q6.2 36.78,39.64 v35.88,38.74 | Q1.2 32.66,39.64 v31.75,38.74 | Q2.2 27.94,39.69 v26.99,38.74 | IC2.5 49.21,15.56 49.53,15.88 | 49.53,15.88 51.43,15.88 51.75,15.56 | 51.75,15.56 IC2.7 | IC2.2 51.75,16.19 | 51.75,16.19 51.75,15.56 | IC2.4 49.21,16.19 49.53,15.88 | C8.2 86.15,49.31 v86.04,49.21 | C9.1 78.84,43.06 | 78.84,43.06 U2.3 | C1.2 78,42.44 v78.11,42.86 78.65,42.86 78.84,43.06 | C2.1 66.46,42.23 U3.3 68.57,42.56 v67.95,43.18 | IC1.5 41.27,15.88 41.91,16.51 | 41.91,16.51 43.5,16.51 43.66,16.35 | 43.66,16.35 43.81,16.19 IC1.7 | IC1.2 43.81,16.51 | 43.81,16.51 43.66,16.35 | IC1.4 41.27,17.15 41.91,16.51 | v44.77,16.51 43.81,16.51 | 51.75,16.19 52.07,16.51 v52.7,16.51 55.14,16.51 C10.1 C3.1 | R13.1 67.68,9.58 v66.68,8.57 | R23.1 v66.36,14.29 | R33.1 v66.36,18.41 | R43.1 v66.36,22.22 | C6.2 C7.2 | IC3.7 31.33,23.28 v31.75,22.86 | ZEN.A 69.76,29.23 | 77.72,29.41 TVS.A | v17.15,22.86 C11.2
  Top 0.406: C5.1 C4.1 16.15,38.09 U9.P$2 8,38.09 C7.2 | TVS.A 76.97,29.98 v79.25,31.62 | 69.76,29.23 72.01,26.99 77.09,26.99 77.72,27.62 77.72,29.41
  Route15 0.406: v84.46,24.77 v84.46,19.68 | v66.36,22.22 v66.36,18.41
  pour Bottom: 0,53.66 101.92,53.66 101.92,40.96 101.6,6.35 101.6,0 92.71,0.32 0,0.32
IN1
  Top 0.254: R54.2 R46.1 42.23,6.99 44.45,4.76 44.45,2.73 ARDUINO_DUE1.A0
IN2
  Top 0.254: R47.1 R55.2 46.35,5.08 46.67,4.76 46.67,2.79 ARDUINO_DUE1.A1
IN3
  Top 0.254: R52.1 R48.2 48.58,5.08 49.21,4.44 49.21,2.79 ARDUINO_DUE1.A2
IN4
  Top 0.254: R49.2 R53.1 53.02,5.72 52.07,4.76 52.07,2.73 ARDUINO_DUE1.A3
N$1
  Top 0.406: D9.C 73.03,34.61 | D9.C PTC.P$2 | D9.C 73.49,29.7 TVS.C
N$2
  Top 0.254: U2.4 76.2,40.64 74.3,41.59 74.3,50.36 ARDUINO_DUE1.19
N$3
  Top 0.254: ARDUINO_DUE1.18 72.26,44.62 U3.1
  Top 0.406: U3.1 U3.2
N$4
  Top 0.254: R5.2 R3.2 34.61,42.86 33.66,41.91 32.98,41.91 Q1.1
N$5
  Top 0.254: R7.2 R8.1 73.29,11.75 76.2,11.75 76.79,11.16 Q3.1
N$6
  Top 0.254: R45.1 IC1.3
N$7
  Top 0.254: R2.2 22.54,50.8 ARDUINO_DUE1.13 22.54,50.93 22.54,52.39 22.86,52.7 84.46,52.7 86.15,51.02 C8.1 R1.1
N$8
  Top 0.254: Q1.3 34.75,38.83 32.73,36.8 | 32.73,36.8 R6.1 | R7.1 71.12,9.84 69.85,11.11 69.85,11.75 68.9,12.7 66.36,12.7 63.5,16.19 63.5,17.46 52.7,30.48 37.15,30.48 34.29,33.34 34.29,35.24 32.73,36.8
N$9
  Top 0.254: R4.2 C9.2 80.54,42.98 U2.1
  Top 0.406: U2.1 U2.2
N$10
  Top 0.254: R14.2 R15.2 41.59,42.27 Q5.1
N$11
  Top 0.254: R9.2 R11.1 28.95,43.24 28.26,42.55 28.26,41.64 Q2.1
N$12
  Top 0.254: R12.1 R13.2 69.22,9.84 71.12,7.94 81.64,7.94 Q4.1
N$13
  Top 0.254: Q2.3 30.31,38.51 R10.1 28.2,36.51 26.99,36.51 26.35,35.88 26.35,34.92 28.26,33.02 33.66,33.02 36.83,29.84 52.39,29.84 62.55,17.15 62.55,15.88 66.99,11.11 R12.2
N$14
  Top 0.254: Q5.3 43.01,39.46 40.51,36.96 | 40.51,36.96 R16.1 | R17.1 71.12,14.29 69.85,15.56 69.85,16.19 68.9,17.15 65.72,17.15 53.34,32.07 47.62,32.07 47.31,32.38 42.23,32.38 41.27,33.34 41.27,36.2 40.51,36.96
N$15
  Top 0.254: R17.2 R18.1 72.71,15.61 72.71,16.19 73.03,16.51 75.88,16.51 76.52,15.87 Q7.1
N$16
  Top 0.254: R19.2 R21.1 38.42,42.23 37.78,41.59 Q6.1
N$17
  Top 0.254: R22.1 R23.2 69.53,14.16 70.48,13.02 82.28,13.02 Q8.1
N$18
  Top 0.254: Q6.3 38.88,39.14 R20.1 36.14,36.51 35.24,36.51 34.92,36.2 34.92,33.97 37.15,31.75 46.99,31.75 47.31,31.43 53.02,31.43 66.04,15.56 R22.2
N$19
  Top 0.254: R24.2 R25.2 49.21,42.18 Q9.1
N$20
  Top 0.254: Q9.3 51.9,40.41 51.53,40.41 50.8,39.69 50.8,38.74 48.45,36.38 | R26.1 48.2,36.32 48.45,36.38 | R27.1 71.12,19.68 69.85,20.95 65.72,20.95 64.45,23.5 63.18,23.5 53.98,33.34 49.53,33.34 48.89,33.97 48.89,35.94 48.45,36.38
N$21
  Top 0.254: R28.1 R27.2 72.71,19.74 72.71,20.32 73.03,20.51 75.57,20.51 75.89,20.32 Q11.1
N$22
  Top 0.254: Q10.1 44.77,41.86 R31.1 R29.2
N$23
  Top 0.254: R32.1 R33.2 69.22,18.41 70.17,17.46 79.38,17.46 80.33,18.41 Q12.1
N$24
  Top 0.254: Q10.3 47.14,40.1 R30.1 43.44,36.51 42.55,36.51 42.23,36.2 42.23,34.29 43.18,33.34 47.94,33.34 48.58,32.7 53.66,32.7 62.55,22.86 63.5,22.86 65.41,19.68 R32.2
N$25
  Top 0.254: R34.2 R35.2 56.41,43.24 Q13.1
N$26
  Top 0.254: Q13.3 60.15,39.46 56.52,37.37 | 56.52,37.37 R36.1 | R37.1 71.12,22.22 70.17,23.18 70.17,24.13 68.9,25.4 64.45,25.4 56.52,33.34 56.52,37.37
N$27
  Top 0.254: R37.2 R38.1 72.71,23.55 72.71,24.77 73.34,25.4 76.2,25.4 76.79,24.81 Q15.1
N$28
  Top 0.254: R39.2 R41.1 52.07,42.86 53.34,41.59 Q14.1
N$29
  Top 0.254: Q16.1 80.33,22.86 79.06,21.59 75.57,21.59 73.53,21.15 70.68,21.15 69.85,22.22 R43.2 R42.1
N$30
  Top 0.254: Q14.3 56.03,39.46 R40.1 51.38,36.51 50.48,36.51 50.16,36.2 50.16,34.29 50.48,33.97 54.29,33.97 63.82,24.45 65.41,24.45 66.36,23.5 R42.2
N$31
  Top 0.254: R44.1 IC1.1
N$32
  Top 0.254: IC2.6 R52.2
N$36
  Top 0.254: IC2.8 R53.2
N$37
  Top 0.254: IC1.6 42.55,11.01 R46.2
N$38
  Top 0.254: IC1.8 45.09,11.33 R47.2
N$41
  Top 0.254: IC2.1 53.02,20.74 R50.1
N$42
  Top 0.406: IC2.3 50.48,20.74 R51.1
RX
  Top 0.254: U$2.P$11 85.83,46.99 R4.1
TX  (via drill 0.38)
  Top 0.254: U3.4 68.57,39.7 v69.53,38.74
  Route2 0.254: v69.53,38.74 84.14,38.74 85.41,37.46 87.07,37.46 U$2.P$13